# EasyEDA Pro project ProPrj_EDA-Piano2_2025-09-29.epro

# Schematic Schematic1_1
Board Name: ESP8266_PWM方案; Create Date: 2025-09-03; Page Name: P1; Project Name: EDA-Piano2; Schematic Name: Schematic1_1; Update Date: 2025-09-28; Company: 嘉立创EDA; Page Size: A4; Version: V1.0
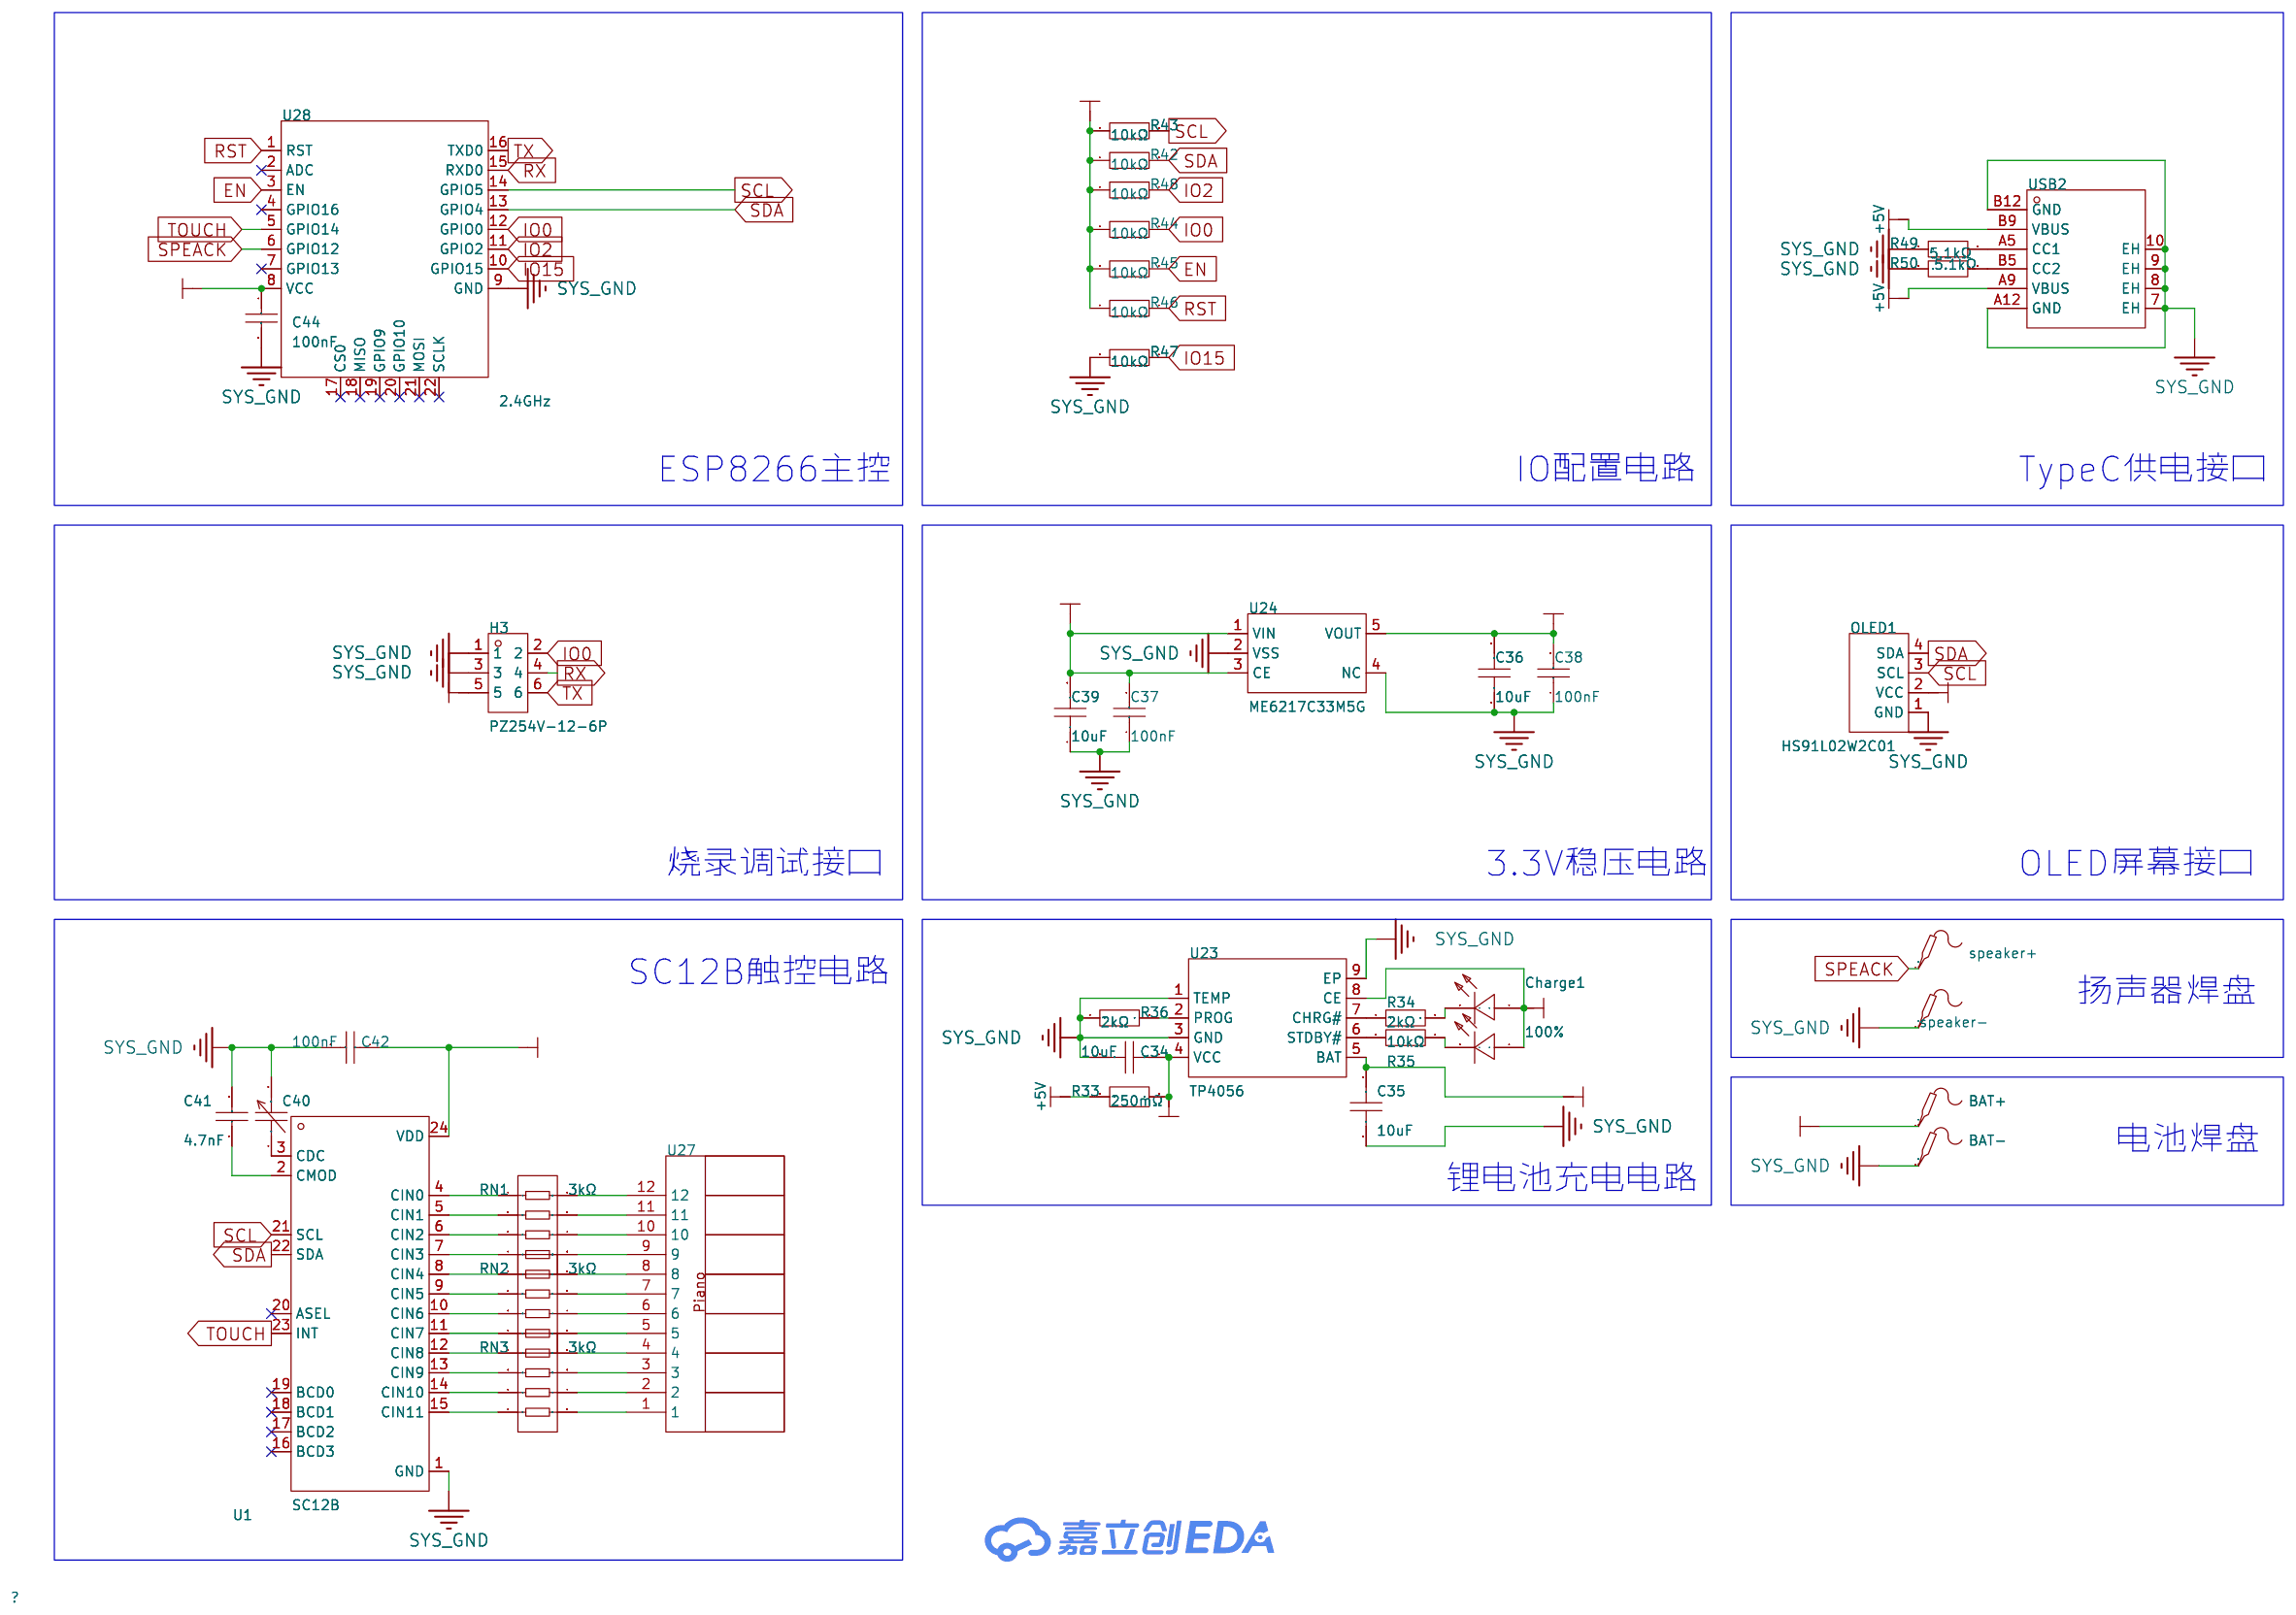
[diagram p0: schematic sheet]

## Parts
100%  NCD0805R1  [LED0805-R-RD]
BAT+  -  [Test-Point-0.5mm]
BAT-  -  [Test-Point-0.5mm]
C34  10uF  [C0805]
C35  10uF  [C0805]
C36  10uF  [C0805]
C37  100nF  [C0805]
C38  100nF  [C0805]
C39  10uF  [C0805]
C40  STC3ME30-T1  [CAP-SMD_L4.5-W3.2_SGC3S200NM]
C41  4.7nF  [C0805]
C42  100nF  [C0805]
C44  100nF  [C0805]
Charge1  NCD0805R1  [LED0805-R-RD]
H3  PZ254V-12-6P  [HDR-TH_6P-P2.54-V-M-R2-C3-S2.54]
OLED1  HS91L02W2C01  [OLED-TH_L38.0-W12.0_HS91L02W2C01]
R33  250mΩ  [R0805]
R34  2kΩ  [R0805]
R35  10kΩ  [R0805]
R36  2kΩ  [R0805]
R42  10kΩ  [R0805]
R43  10kΩ  [R0805]
R44  10kΩ  [R0805]
R45  10kΩ  [R0805]
R46  10kΩ  [R0805]
R47  10kΩ  [R0805]
R48  10kΩ  [R0805]
R49  5.1kΩ  [R0805]
R50  5.1kΩ  [R0805]
RN1  3kΩ  [RES-ARRAY-SMD_0603-8P-L3.2-W1.6-BL]
RN2  3kΩ  [RES-ARRAY-SMD_0603-8P-L3.2-W1.6-BL]
RN3  3kΩ  [RES-ARRAY-SMD_0603-8P-L3.2-W1.6-BL]
speaker+  -  [Test-Point-0.5mm]
speaker-  -  [Test-Point-0.5mm]
U1  SC12B  [SSOP-24_L8.7-W3.9-P0.64-LS6.0-BL]
U23  TP4056  [ESOP-8_L4.9-W3.9-P1.27-LS6.0-BL-EP]
U24  ME6217C33M5G  [SOT-23-5_L3.0-W1.7-P0.95-LS2.8-BR]
U27  -  [Piano]
U28  2.4GHz  [WIFIM-SMD_ESP-12F-ESP8266MOD]
USB2  U262-061N-4BVC11  [USB-SMD_U262-061N-4BVC11]

## Library data of the parts
100% Charge1 = NCD0805R1: 灯头类型:-;发光颜色:红色;正向电压(VF):1.6V~2.6V;功率:65mW;正向电流:20mA;主波长:615nm~630nm;二极管配置:独立二极管;透镜颜色:无色透明透镜;色温:-;发光强度:67mcd~195mcd;发光角度:130°;载带方式:-;工作温度:-30℃~+85℃;; Supplier Part: C84256; Manufacturer: 国星光电; Supplier Footprint: 0805; JLCPCB Part Class: Basic Part; Datasheet: https://atta.szlcsc.com/upload/public/pdf/source/20200820/C84256_F0A75A43B3EAD75808600A0514C76B99.pdf; Supplier: LCSC; Emitted Color: 红色; Forward Voltage (VF): 1.6V~2.6V; Power Dissipation: 65mW; Forward Current: 20mA; Dominant Wavelength: 615nm~630nm; Diode Configuration: 独立二极管; Lens Color: 无色透明透镜; Luminous Intensity: 67mcd~195mcd; Viewing Angle: 130°; Operating Temperature: -30℃~+85℃
BAT+ BAT- speaker+ speaker- = Test-Point: Test Point 测试点
C34 C35 = CGA0805X5R106K250MT: 容值:10uF;精度:±10%;额定电压:25V;温度系数:X5R;; LCSC Part Name: 10uF ±10% 25V; Supplier Part: C6119887; Manufacturer: HRE(芯声); Supplier Footprint: 0805; JLCPCB Part Class: Extended Part; Supplier: LCSC; Tolerance: ±10%; Voltage Rating: 25V; Temperature Coefficient: X5R
C36 C39 = CL21A106KAYNNNE_C15850: 容值:10uF;精度:±10%;额定电压:25V;材质(温度系数):X5R;; LCSC Part Name: 10uF ±10% 25V; Supplier Part: C15850; Manufacturer: SAMSUNG(三星); Manufacturer Part: CL21A106KAYNNNE; Supplier Footprint: 0805; JLCPCB Part Class: 基础库; Datasheet: https://atta.szlcsc.com/upload/public/pdf/source/20160218/1457707763339.pdf; Supplier: LCSC; Tolerance: ±10%; Voltage Rated: 25V; Temperature Coefficient: X5R
C37 C38 C42 C44 = FCC0805B104K500DT: 容值:100nF;精度:±10%;额定电压:50V;温度系数:X7R;; LCSC Part Name: 100nF ±10% 50V; Supplier Part: C5137467; Manufacturer: FOJAN(富捷); Supplier Footprint: 0805; JLCPCB Part Class: Extended Part; Datasheet: https://atta.szlcsc.com/upload/public/pdf/source/20220818/0EB3B7FB2F5648AC16609637FBA7DABE.pdf; Supplier: LCSC; Tolerance: ±10%; Voltage Rating: 50V; Temperature Coefficient: X7R
C40 = STC3ME30-T1_C22468123: 静电容量:8pF~28.5pF;静电容量公差:0%~+50%;额定电压(Vdc):100V;Q值:250@1MHz;; LCSC Part Name: 8pF~28.5pF 100V; Supplier Part: C22468123; Manufacturer: SEHWA(韩国世华); Supplier Footprint: SMD,4.5x3.2mm; JLCPCB Part Class: 扩展库; Datasheet: https://atta.szlcsc.com/upload/public/pdf/source/20240625/55C7A7A8763FD4208BA2F5E12AB1C3D3.pdf; Supplier: LCSC; electrostatic capacity: 8pF~28.5pF; Tolerance: 0%~+50%; Rated Voltage: 100V; Q @ Freq: 250@1MHz; Operating Temperature: -25℃~+85℃; Body Length: 4.5mm; Body Width: 3.2mm; Body Height: 1.5mm
C41 = 0805B472K500NT: 容值:4.7nF;精度:±10%;额定电压:50V;温度系数:X7R;; LCSC Part Name: 4.7nF ±10% 50V; Supplier Part: C1744; Manufacturer: FH(风华); Supplier Footprint: 0805; JLCPCB Part Class: 基础库; Datasheet: https://atta.szlcsc.com/upload/public/pdf/source/20200305/C486355_26A10D38EF8C2A5C37091D0039909270.pdf; Supplier: LCSC; Tolerance: ±10%; Voltage Rating: 50V; Temperature Coefficient: X7R
H3 = PZ254V-12-6P: 插针结构:2x3P;间距:2.54mm;行距:2.54mm;圆针/方针:方针;安装类型:直插;排数:双排;总PIN位数:6P;额定电流:-;额定电压:-;配合针长度:6mm;塑高:2.5mm;端接针长度:3mm;触头材质:黄铜;触头镀层:-;工作温度范围:-40℃~+105℃;颜色:黑色;; LCSC Part Name: 间距:2.54mm 2x3P 直插 方针; Supplier Part: C492420; Manufacturer: XFCN(兴飞); Supplier Footprint: 插件,P=2.54mm; JLCPCB Part Class: 扩展库; Datasheet: https://atta.szlcsc.com/upload/public/pdf/source/20200309/C492420_BAECB307B001054C09D200388220EAE6.pdf; Supplier: LCSC; Pin Structure: 2x3P; Pitch: 2.54mm; Row Spacing: 2.54mm; Circluar Pins/Square Pins: 方针; Mounting Type: 直插; Number of Rows: 双排; Number of Pins: 6P; Length of Mating Pin: 6mm; Insulation Height: 2.5mm; Length of End Connection Pin: 3mm; Contact Material: 黄铜; Operating Temperature Range: -40℃~+105℃; Color: 黑色
OLED1 = HS91L02W2C01: 主控芯片:SSD1306;接口类型:I2C;尺寸(inch):0.91;像素分辨率:128x32;; LCSC Part Name: 0.91寸OLED显示屏白光IIC; Supplier Part: C5248081; Manufacturer: HS(汉昇); JLCPCB Part Class: 扩展库; Datasheet: https://atta.szlcsc.com/upload/public/pdf/source/20230727/C3E43C8E3DDA847F5681FEE7D95C153D.pdf; Supplier: LCSC; Main Control Chip: SSD1306; Interface Type: I2C; Size: 0.91; Pixel Resolution: 128x32; Operating Temperature: -40℃~+70℃
R33 = FRL0805JR250TS: 电阻类型:厚膜电阻;阻值:250mΩ;精度:±5%;功率:125mW;最大工作电压:300V;温度系数:±300ppm/℃;; LCSC Part Name: 250mΩ ±5% 125mW 厚膜电阻; Supplier Part: C2930324; Manufacturer: FOJAN(富捷); Supplier Footprint: 0805; JLCPCB Part Class: 扩展库; Datasheet: https://atta.szlcsc.com/upload/public/pdf/source/20211221/925EC7D7225764EE0046F22065062C87.pdf; Supplier: LCSC; Type: 厚膜电阻; Tolerance: ±5%; Power(Watts): 125mW; Overload Voltage (Max): 300V; Temperature Coefficient: ±300ppm/℃; Operating Temperature Range: -55℃~+155℃
R34 R36 = 0805W8F2001T5E: 电阻类型:厚膜电阻;阻值:2kΩ;精度:±1%;功率:125mW;最大工作电压:150V;温度系数:±100ppm/℃;; LCSC Part Name: 2kΩ ±1% 125mW 厚膜电阻; Supplier Part: C17604; Manufacturer: UNI-ROYAL(厚声); Supplier Footprint: 0805; JLCPCB Part Class: 基础库; Datasheet: https://atta.szlcsc.com/upload/public/pdf/source/20200306/C422600_1E6D84923E4A46A82E41ADD87F860B5C.pdf; Supplier: LCSC; Type: 厚膜电阻; Tolerance: ±1%; Power(Watts): 125mW; Overload Voltage (Max): 150V; Temperature Coefficient: ±100ppm/℃; Operating Temperature Range: -55℃~+155℃
R35 R42-R48 = 0805W8F1002T5E_C17414: 电阻类型:厚膜电阻;阻值:10kΩ;精度:±1%;功率:125mW;最大工作电压:150V;温度系数:±100ppm/℃;; LCSC Part Name: 10kΩ ±1% 125mW 厚膜电阻; Supplier Part: C17414; Manufacturer: UNI-ROYAL(厚声); Manufacturer Part: 0805W8F1002T5E; Supplier Footprint: 0805; JLCPCB Part Class: Basic Part; Datasheet: https://atta.szlcsc.com/upload/public/pdf/source/20200306/C422600_1E6D84923E4A46A82E41ADD87F860B5C.pdf; Supplier: LCSC; Type: 厚膜电阻; Tolerance: ±1%; Power(Watts): 125mW; Overload Voltage (Max): 150V; Temperature Coefficient: ±100ppm/℃; Operating Temperature Range: -55℃~+155℃
R49 R50 = 0805W8F5101T5E: 电阻类型:厚膜电阻;阻值:5.1kΩ;精度:±1%;功率:125mW;工作电压:150V;温度系数:±100ppm/℃;; LCSC Part Name: 5.1kΩ ±1% 125mW 厚膜电阻; Supplier Part: C27834; Manufacturer: UNI-ROYAL(厚声); Supplier Footprint: 0805; JLCPCB Part Class: 基础库; Datasheet: https://item.szlcsc.com/datasheet/0805W8F5101T5E/28584.html; Supplier: LCSC; Type: 厚膜电阻; Tolerance: ±1%; Power(Watts): 125mW; Voltage-Supply(Max): 150V; Temperature Coefficient: ±100ppm/℃; Operating Temperature: -55℃~+155℃
RN1-RN3 = 4D03WGF3001T5E: 电阻器数:4;阻值:3kΩ;精度:±1%;单个元件功率:62.5mW;温度系数:±200ppm/℃;; LCSC Part Name: 3kΩ ±1%; Supplier Part: C425221; Manufacturer: UNI-ROYAL(厚声); Supplier Footprint: 0603x4; JLCPCB Part Class: 扩展库; Datasheet: https://item.szlcsc.com/datasheet/4D03WGF3001T5E/418845.html; Supplier: LCSC; Number of Resistors: 4; Tolerance: ±1%; Power(Watts): 62.5mW; Temperature Coefficient: ±200ppm/℃; Number of Pins: 8
U1 = SC12B: 通道数:12;芯片功能:电容式触摸;是否自锁:-;; LCSC Part Name: 12通道高性能触摸芯片,2.5V-6V; Supplier Part: C718973; Manufacturer: icman(晶尊微); Supplier Footprint: SSOP-24-150mil; JLCPCB Part Class: 扩展库; Datasheet: https://item.szlcsc.com/datasheet/SC12B/761516.html; Supplier: LCSC; Number of Channels: 12; Chip Function: 电容式触摸; Voltage - Supply: 2.5V~6V; Operating Temperature: -40℃~+85℃
U23 = TP4056_C725790: Supplier Part: C725790; Manufacturer: UMW(友台半导体); Supplier Footprint: ESOP-8; JLCPCB Part Class: 扩展库; Datasheet: https://atta.szlcsc.com/upload/public/pdf/source/20231109/CF74897CE79A500F7FE27A45ADCCC631.pdf; Supplier: LCSC
U24 = ME6217C33M5G: 输出类型:固定;工作电压:6.5V;输出电压:3.3V;输出电流:800mA;电源纹波抑制比(PSRR):65dB@(1kHz);输出极性:正极;; LCSC Part Name: 输入7V 输出3.3V 800mA; Supplier Part: C427602; Manufacturer: MICRONE(南京微盟); Supplier Footprint: SOT-23-5; JLCPCB Part Class: 扩展库; Datasheet: https://atta.szlcsc.com/upload/public/pdf/source/20190910/C427602_D4B9162A2E9D9EF57C60010DFDECEF37.pdf; Supplier: LCSC; Output Type: 固定; Voltage - Supply: 6.5V; Output Voltage: 3.3V; Output Current: 800mA; Power Supply Rejection Ratio (PSRR): 65dB@(1kHz); Voltage Dropout: 180mV@(300mA); standby current: 100uA; Features: 过热保护；带使能; Operating Temperature: -40℃~+85℃; Output Configuration: 正极; Number of Outputs: 1
U27 = Piano
U28 = ESP-12F(ESP8266MOD): 核心处理器:ESP8266芯片;频率:2.4GHz;天线形式:板载PCB天线;发射功率:16dBm;接收灵敏度:-90dBm;; LCSC Part Name: 完整的802.11b/g/nWi-FiSoC模块 屏蔽罩上的丝印是：ESP8266MOD，ESP8266EX串口WIFI; Supplier Part: C82891; Manufacturer: Ai-Thinker(安信可); Supplier Footprint: SMD,16x24mm; JLCPCB Part Class: 扩展库; Datasheet: https://atta.szlcsc.com/upload/public/pdf/source/20210219/C82891_ABD84A460F4F056A2757267CCCA4B508.pdf; Supplier: LCSC; Core Processor: ESP8266芯片; Support Interface: GPIO；UART；I2C；PWM；SPI；ADC; Antenna Type: 板载PCB天线; Output Power: 16dBm; Operating Voltage: 3.3V; Receive  Current: 120mA; Send  Current: 170mA; Sensitivity: -90dBm; Operating Temperature: -40℃~+85℃
USB2 = U262-061N-4BVC11: 连接器类型:Type-C;标准:USB 3.1;公母:母;端口数量:1;触点数量:6P;安装方式:卧贴;额定电流 - 电源:5A;触头材质:铜合金;触头镀层:金;工作温度范围:-25℃~+85℃;焊接温度(最大值):260℃;; LCSC Part Name: Type-C 母 卧贴; Supplier Part: C2764612; Manufacturer: XKB Connection(中国星坤); Supplier Footprint: SMD; JLCPCB Part Class: 扩展库; Datasheet: https://atta.szlcsc.com/upload/public/pdf/source/20210602/C2764612_915BA3D27A0B76A9D989108E3A082B29.pdf; Supplier: LCSC; Connector Type: Type-C; Standard: USB 3.1; Gender: 母; Number of Ports: 1; Number of Contacts: 6P; Mounting Style: 卧贴; Current Rating - Power (Max): 5A; Contact Material: 铜合金; Contact Plating: 金; Operating Temperature Range: -25℃~+85℃; Soldering Temperature(Max): 260℃

## Nets
+5V: R33.1 USB2.A9(VBUS) USB2.B9(VBUS)
BAT: BAT+.1 C35.1 C37.2 C39.2 U23.5(BAT) U24.1(VIN) U24.3(CE)
EN: R45.1 U28.3(EN)
IO0: H3.2 R44.1 U28.12(GPIO0)
IO2: R48.1 U28.11(GPIO2)
IO15: R47.1 U28.10(GPIO15)
RST: R46.1 U28.1(RST)
RX: H3.4 U28.15(RXD0)
SCL: OLED1.3(SCL) R43.2 U1.21(SCL) U28.14(GPIO5)
SDA: OLED1.4(SDA) R42.2 U1.22(SDA) U28.13(GPIO4)
SPEACK: speaker+.1 U28.6(GPIO12)
SYS_GND: BAT-.1 C34.2 C35.2 C36.1 C37.1 C38.1 C39.1 C40.2 C41.2 C42.2 C44.2 H3.1 H3.3 OLED1.1(GND) R36.1 R47.2 R49.1 R50.1 speaker-.1 U1.1(GND) U23.1(TEMP) U23.3(GND) U23.9(EP) U24.2(VSS) U24.4(NC) U28.9(GND) USB2.7(EH) USB2.8(EH) USB2.9(EH) USB2.10(EH) USB2.A12(GND) USB2.B12(GND)
SYSTEM_3V3: C36.2 C38.2 C42.1 C44.1 H3.5 OLED1.2(VCC) R42.1 R43.1 R44.2 R45.2 R46.2 R48.2 U1.24(VDD) U24.5(VOUT) U28.8(VCC)
TOUCH: U1.23(INT) U28.5(GPIO14)
TP4056_VCC: 100%.1(+) C34.1 Charge1.1(+) R33.2 U23.4(VCC) U23.8(CE)
TX: H3.6 U28.16(TXD0)
$1N1082: 100%.2(-) R35.1
$1N1083: R35.2 U23.6(STDBY#)
$1N1087: R34.1 U23.7(CHRG#)
$1N1088: Charge1.2(-) R34.2
$1N1093: R36.2 U23.2(PROG)
$1N5168: C40.1 U1.3(CDC)
$1N5240: C41.1 U1.2(CMOD)
$1N9530: RN1.4 U1.4(CIN0)
$1N9534: RN1.5 U27.12
$1N9539: RN1.6 U27.11
$1N9544: RN1.7 U27.10
$1N9549: RN1.8 U27.9
$1N9554: RN2.5 U27.8
$1N9559: RN2.6 U27.7
$1N9564: RN2.7 U27.6
$1N9569: RN2.8 U27.5
$1N9574: RN3.5 U27.4
$1N9579: RN3.6 U27.3
$1N9584: RN3.7 U27.2
$1N9589: RN3.8 U27.1
$1N9594: RN3.1 U1.15(CIN11)
$1N9599: RN3.2 U1.14(CIN10)
$1N9607: RN3.3 U1.13(CIN9)
$1N9626: RN2.2 U1.10(CIN6)
$1N9631: RN2.3 U1.9(CIN5)
$1N9636: RN2.4 U1.8(CIN4)
$1N9641: RN1.1 U1.7(CIN3)
$1N9648: RN1.2 U1.6(CIN2)
$1N9654: RN1.3 U1.5(CIN1)
$1N9658: RN2.1 U1.11(CIN7)
$1N9661: RN3.4 U1.12(CIN8)
$1N13236: R49.2 USB2.A5(CC1)
$1N13292: R50.2 USB2.B5(CC2)

Not connected (* = marked no-connect by the designer): U1 16(BCD3)* 17(BCD2)* 18(BCD1)* 19(BCD0)* 20(ASEL)*; U28 2(ADC)* 4(GPIO16)* 7(GPIO13)* 17(CS0)* 18(MISO)* 19(GPIO9)* 20(GPIO10)* 21(MOSI)* 22(SCLK)*

## Notes on the sheet
- ESP8266主控
- IO配置电路
- TypeC供电接口
- 烧录调试接口
- 3.3V稳压电路
- OLED屏幕接口
- SC12B触控电路
- 扬声器焊盘
- 电池焊盘
- 锂电池充电电路

# Board PCB1_1
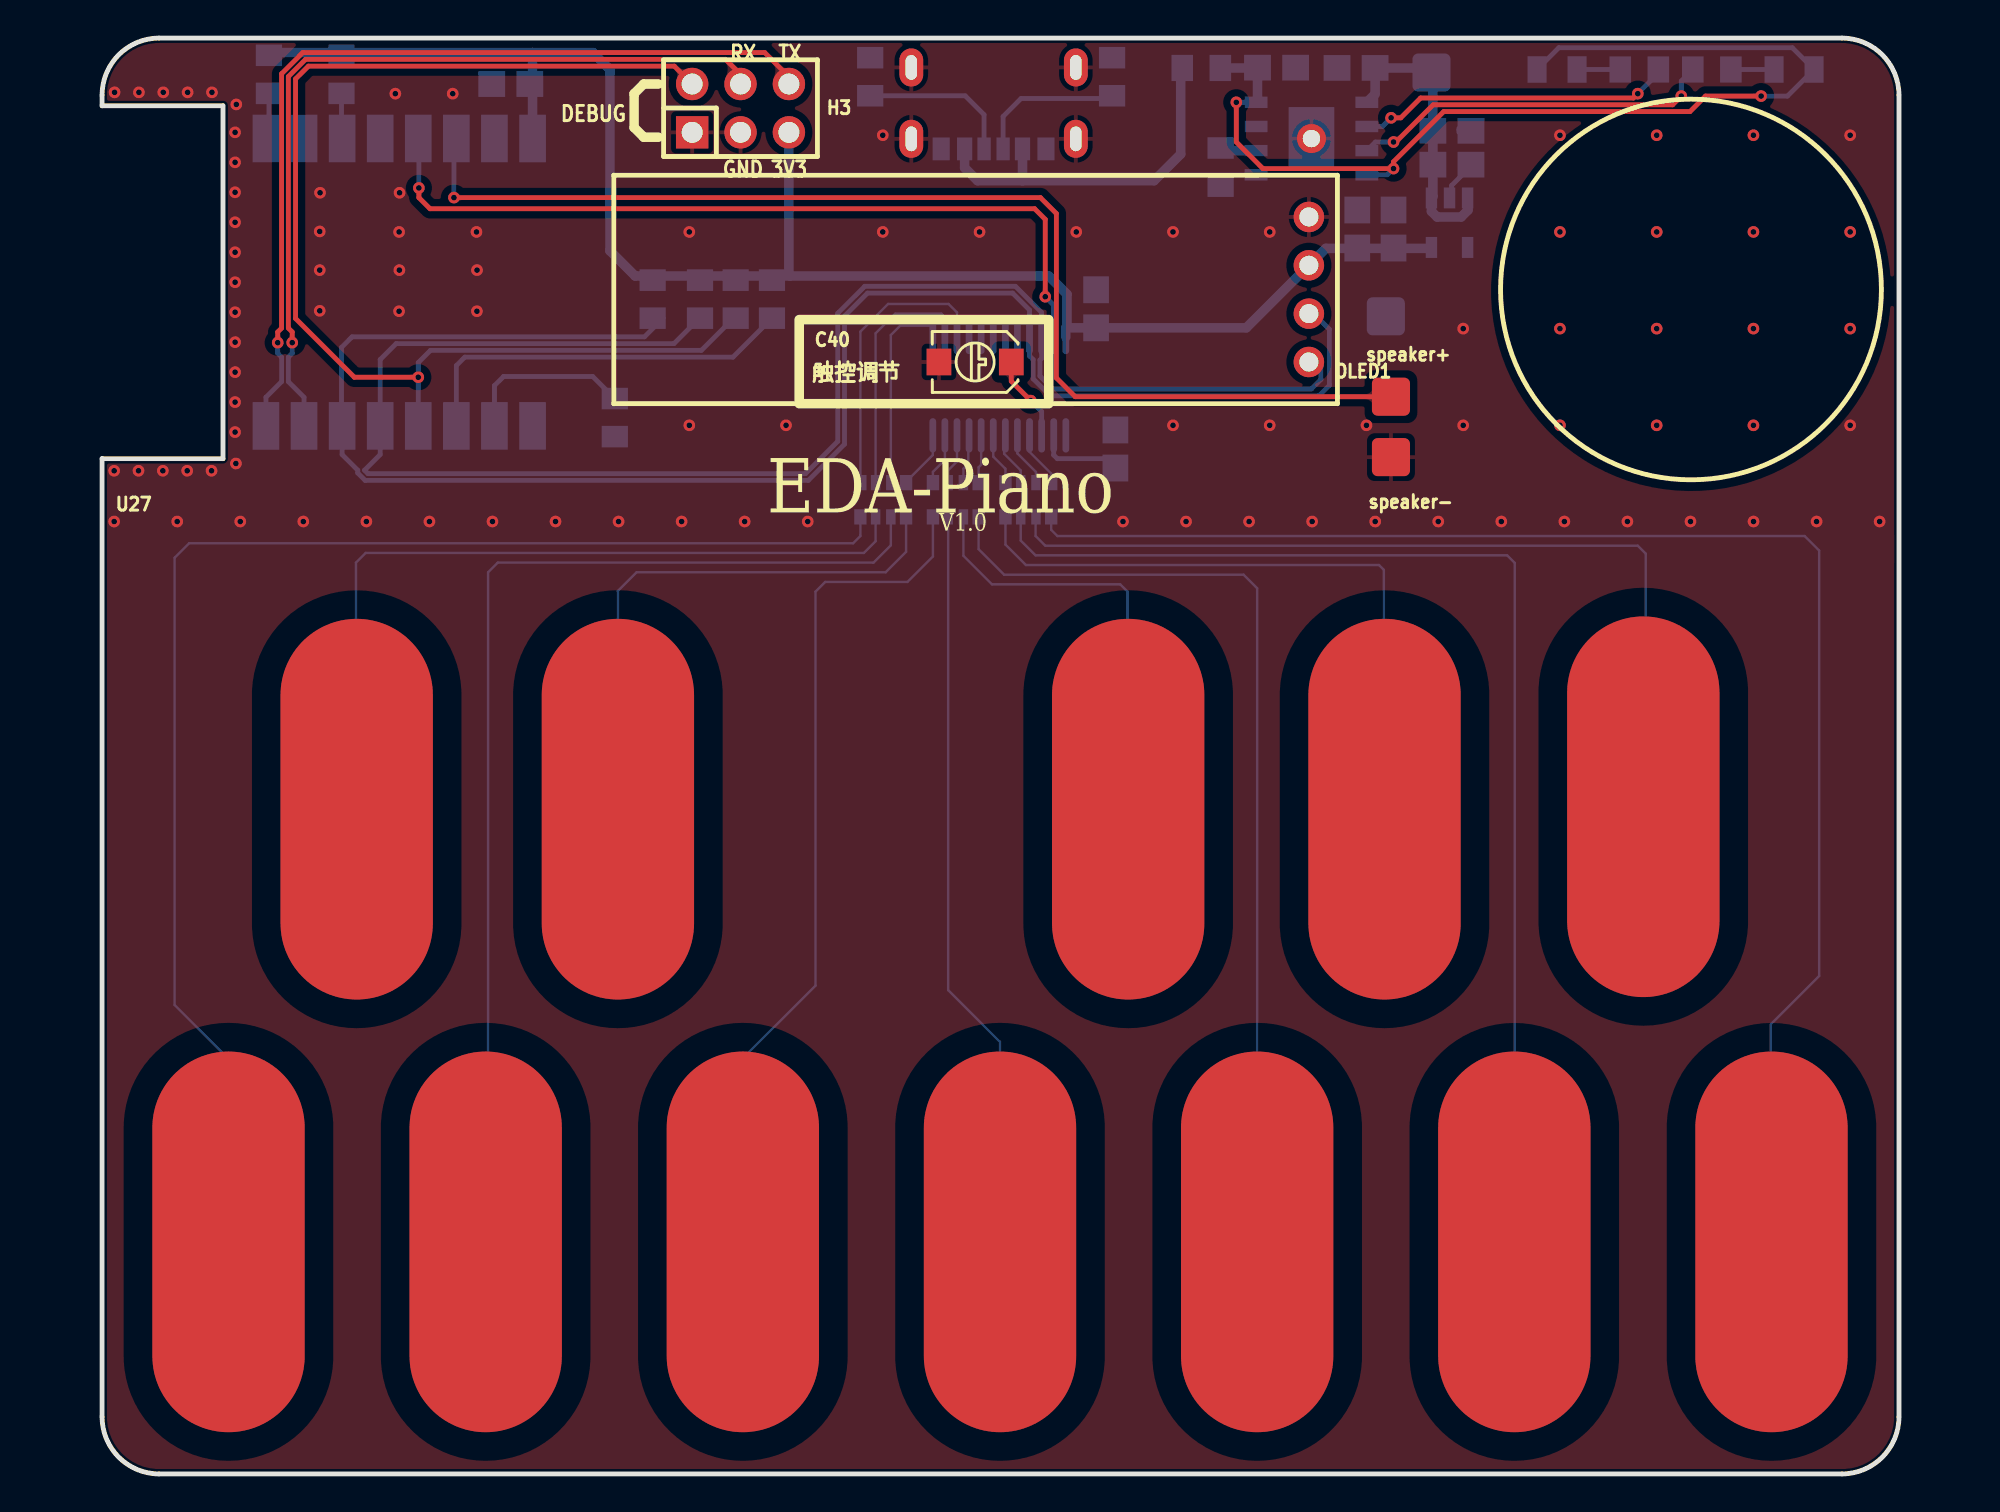
[diagram p1: board, top side]
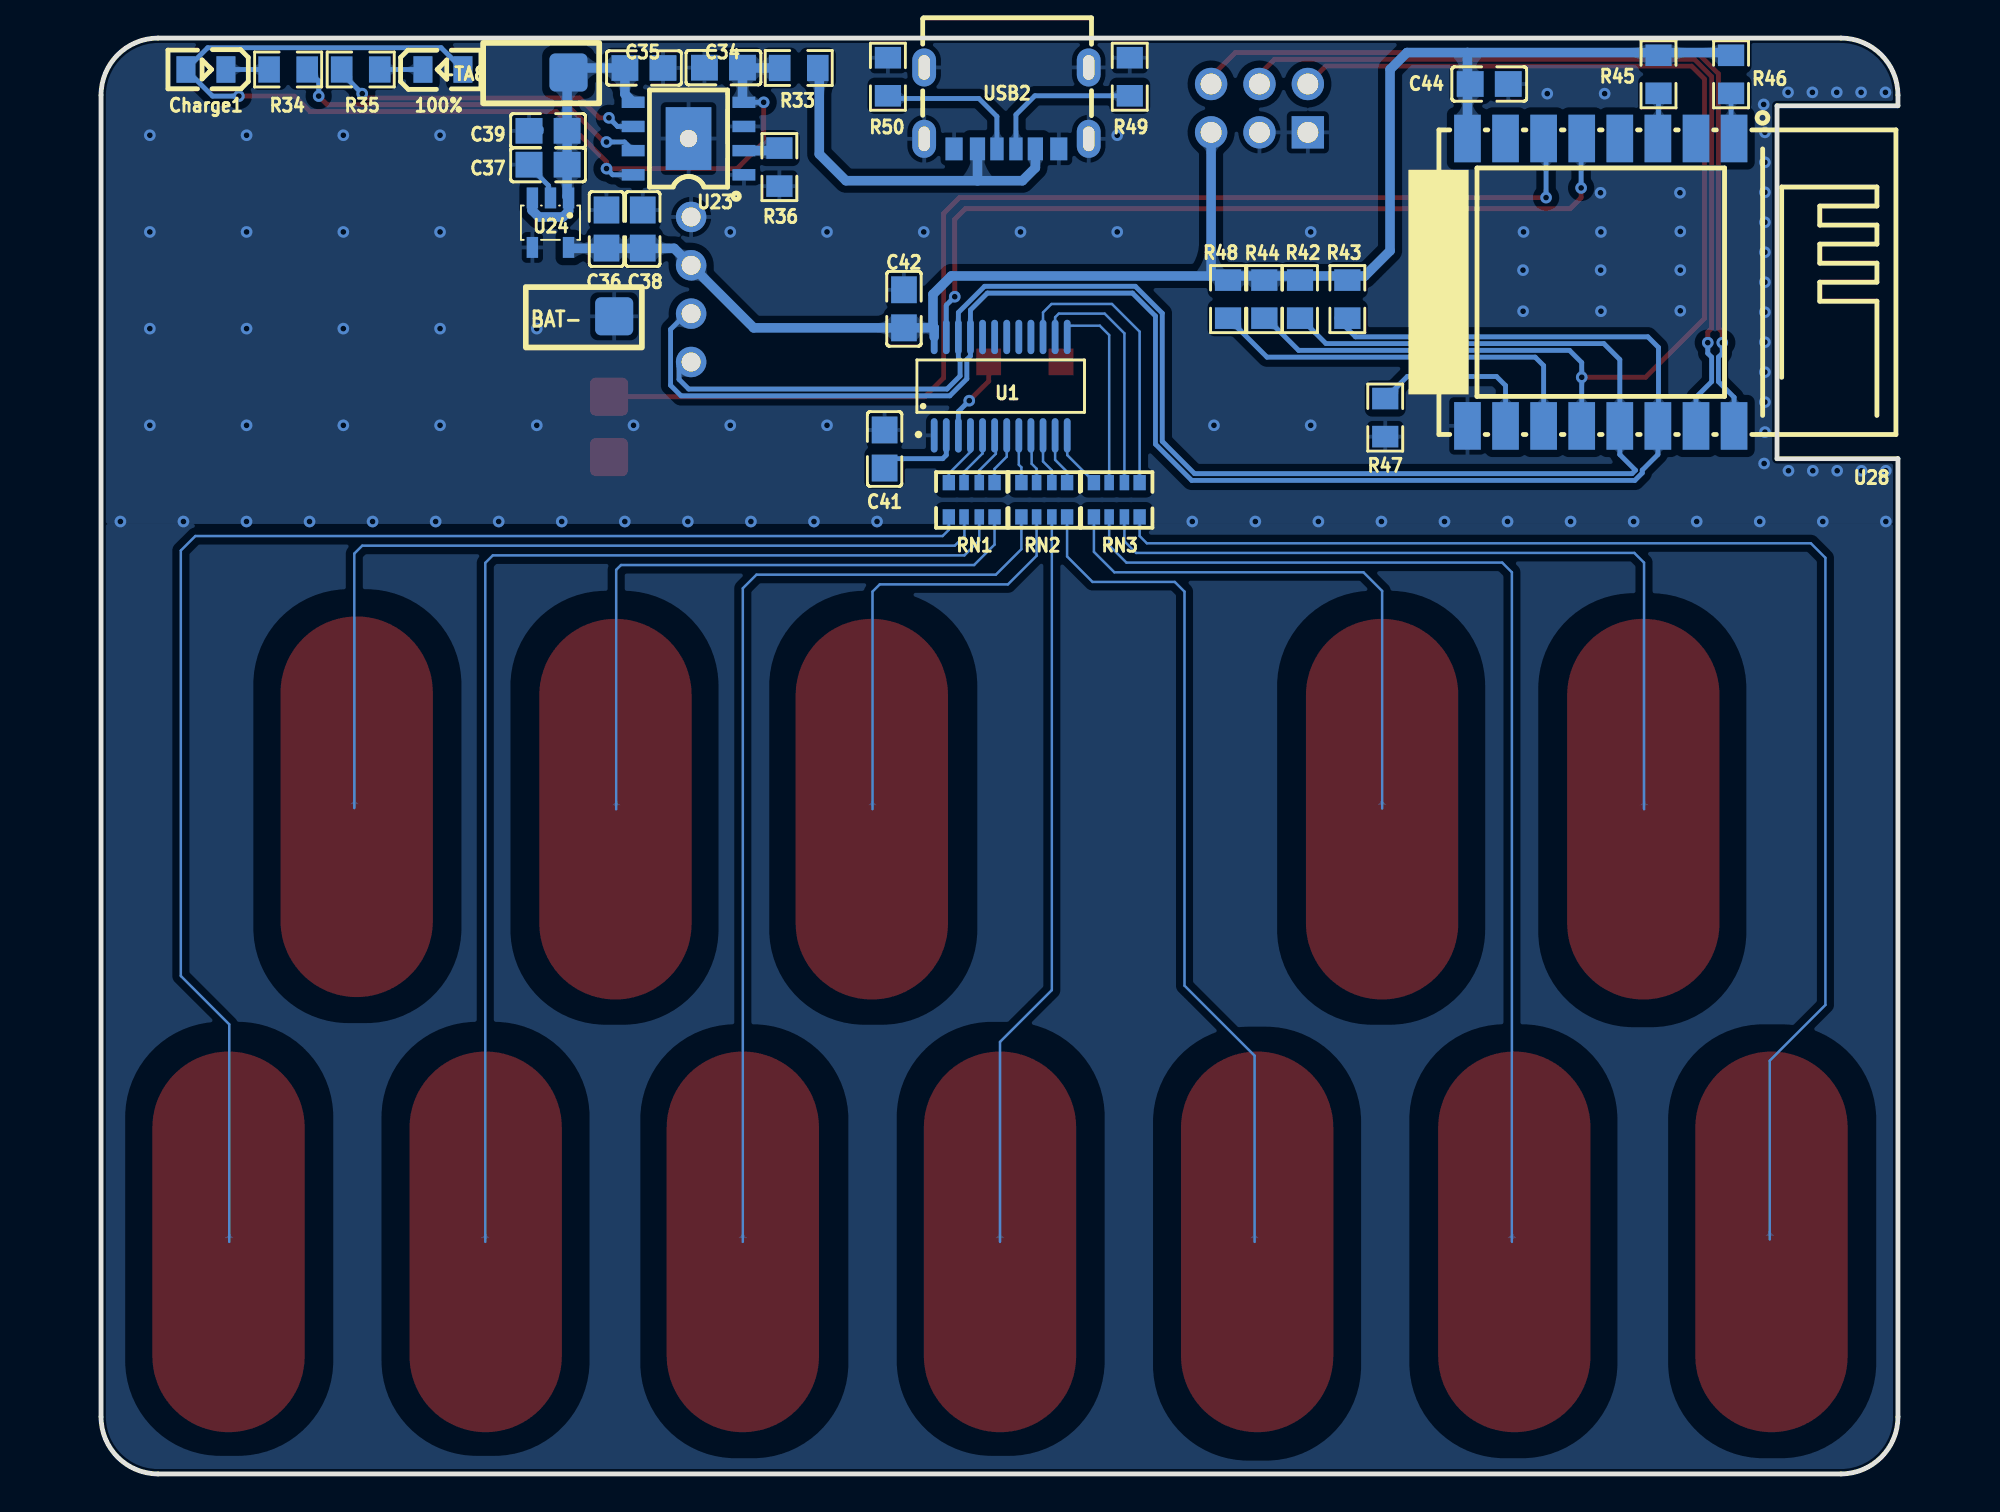
[diagram p2: board, bottom side, seen from below]

Outline 94.36 x 75.44 mm; copper layers: Top Layer, Bottom Layer. Coordinates in mm from the lower left corner of the outline.
Outline path: 0,72.44 0,71.88 6.35,71.88 6.35,53.34 0,53.34 0,3 arc(0.88,0.88) 3,0 91.36,0 arc(93.48,0.88) 94.36,3 94.36,72.44 arc(93.48,74.56) 91.36,75.44 3,75.44 arc(0.88,74.56) 0,72.44
Stack: Top Layer 0.035mm / Dielectric1 1.51mm FR4 er 4.5 / Bottom Layer 0.035mm

## Design rules (mm)
template: 自定义配置
spacing copperThickness1oz (default): track to track 0.102, other pairs 0.152 to 0.3
spacing copperThickness2oz: track to track 0.381, other pairs 0.152 to 0.3
track width copperThickness1oz (default): min 0.127, default 0.254, max 2.54
track width copperThickness2oz: min 0.127, default 0.127, max 0.203
differential pair differentialPair (default): width min 0.127, default 0.254, max 2.54; gap min 0.152, default 0.152
via viaSize (default): diameter min 0.5, default 0.61, max 10; hole min 0.3, default 0.305, max 6.3
net $1N9648 uses copperThickness2oz
net $1N9641 uses copperThickness2oz
net $1N9626 uses copperThickness2oz
net $1N9599 uses copperThickness2oz
net $1N9594 uses copperThickness2oz
net $1N9530 uses copperThickness2oz
net $1N9654 uses copperThickness2oz
net $1N9636 uses copperThickness2oz
net $1N9631 uses copperThickness2oz
net $1N9607 uses copperThickness2oz
net $1N9589 uses copperThickness2oz
net $1N9584 uses copperThickness2oz
net $1N9579 uses copperThickness2oz
net $1N9574 uses copperThickness2oz
net $1N9569 uses copperThickness2oz
net $1N9564 uses copperThickness2oz
net $1N9559 uses copperThickness2oz
net $1N9554 uses copperThickness2oz
net $1N9549 uses copperThickness2oz
net $1N9544 uses copperThickness2oz
net $1N9539 uses copperThickness2oz
net $1N9534 uses copperThickness2oz
pour e21 uses copperRegion1

## Placement (name value [footprint] x y rotation side)
100%  NCD0805R1  [LED0805-R-RD]  76.41 73.79 180 bottom
BAT+  -  [Test-Point-0.5mm#2]  69.81 73.63 0 top
BAT-  -  [Test-Point-0.5mm#2]  67.41 60.82 0 top
C34  10uF  [C0805]  61.68 73.88 0 bottom
C35  10uF  [C0805]  65.85 73.87 180 bottom
C36  10uF  [C0805]  67.82 65.4 270 bottom
C37  100nF  [C0805]  70.89 68.79 180 bottom
C38  100nF  [C0805]  65.91 65.4 270 bottom
C39  10uF  [C0805]  70.89 70.56 180 bottom
C40  STC3ME30-T1  [CAP-SMD_L4.5-W3.2_SGC3S200NM]  45.85 58.42 180 top
C41  4.7nF  [C0805]  53.21 53.85 90 bottom
C42  100nF  [C0805]  52.2 61.21 90 bottom
C44  100nF  [C0805]  21.46 73.02 180 bottom
Charge1  NCD0805R1  [LED0805-R-RD]  88.85 73.79 0 bottom
H3  PZ254V-12-6P  [HDR-TH_6P-P2.54-V-M-R2-C3-S2.54]  33.53 71.75 0 top
NOREF  -  [Pad_e327]  63.51 70.16 0 top
OLED1  HS91L02W2C01  [OLED-TH_L38.0-W12.0_HS91L02W2C01]  63.37 62.23 180 top
R33  250mΩ  [R0805]  57.72 73.87 0 bottom
R34  2kΩ  [R0805]  84.53 73.79 0 bottom
R35  10kΩ  [R0805]  80.72 73.79 0 bottom
R36  2kΩ  [R0805]  58.74 68.66 90 bottom
R42  10kΩ  [R0805]  31.4 61.72 270 bottom
R43  10kΩ  [R0805]  28.91 61.72 270 bottom
R44  10kΩ  [R0805]  33.27 61.72 90 bottom
R45  10kΩ  [R0805]  12.57 73.53 90 bottom
R46  10kΩ  [R0805]  8.76 73.53 90 bottom
R47  10kΩ  [R0805]  26.92 55.5 270 bottom
R48  10kΩ  [R0805]  35.18 61.72 90 bottom
R49  5.1kΩ  [R0805]  40.34 73.41 270 bottom
R50  5.1kΩ  [R0805]  53.04 73.41 270 bottom
RN1  3kΩ  [RES-ARRAY-SMD_0603-8P-L3.2-W1.6-BL]  48.64 51.18 0 bottom
RN2  3kΩ  [RES-ARRAY-SMD_0603-8P-L3.2-W1.6-BL]  44.83 51.18 0 bottom
RN3  3kΩ  [RES-ARRAY-SMD_0603-8P-L3.2-W1.6-BL]  41.02 51.18 0 bottom
speaker+  -  [Test-Point-0.5mm]  67.68 56.6 0 top
speaker-  -  [Test-Point-0.5mm]  67.68 53.42 0 top
U1  SC12B  [SSOP-24_L8.7-W3.9-P0.64-LS6.0-BL]  47.12 57.15 180 bottom
U23  TP4056  [ESOP-8_L4.9-W3.9-P1.27-LS6.0-BL-EP]  63.51 70.16 90 bottom
U24  ME6217C33M5G  [SOT-23-5_L3.0-W1.7-P0.95-LS2.8-BR]  70.76 65.74 90 bottom
U27  -  [Piano]  -2.29 1.14 0 top
U28  2.4GHz  [WIFIM-SMD_ESP-12F-ESP8266MOD]  16.26 62.61 0 bottom
USB2  U262-061N-4BVC11  [USB-SMD_U262-061N-4BVC11]  46.82 71.75 0 bottom

## Footprints (pads in the part's own frame, mm; a bottom-side part is the same pattern mirrored in y, then rotated)
C0805
  rect 1.41x1.35 smd: 1(-1,0) 2(1,0)
CAP-SMD_L4.5-W3.2_SGC3S200NM
  rect 1.3x1.4 smd: 1(-1.9,0) 2(1.9,0)
ESOP-8_L4.9-W3.9-P1.27-LS6.0-BL-EP
  rect 0.6x1.2 smd: 1(-1.905,-2.909) 2(-0.635,-2.909) 3(0.635,-2.909) 4(1.905,-2.909) 5(1.905,2.909) 6(0.635,2.909) 7(-0.635,2.909) 8(-1.905,2.909)
  rect 3.3x2.4 smd: 9(0,0)
HDR-TH_6P-P2.54-V-M-R2-C3-S2.54
  rect 1.7x1.7 hole 1.1: 1(-2.54,-1.27)
  round 1.7 hole 1.1: 2(-2.54,1.27) 3(0,-1.27) 4(0,1.27) 5(2.54,-1.27) 6(2.54,1.27)
LED0805-R-RD
  rect 1x1.399 smd: 1(1.05,0) 2(-1.05,0)
OLED-TH_L38.0-W12.0_HS91L02W2C01
  round 1.6 hole 1: 1(0,-3.81) 2(0,-1.27) 3(0,1.27) 4(0,3.81)
Pad_e327
  round 1.524 hole 0.914: 1(0,0)
Piano
  oval 8x20 smd: 1(8.927,11.049) 2(15.658,33.782) 3(22.431,11.049) 4(29.373,33.782) 5(35.935,11.049) 6(49.44,11.049) 7(56.17,33.782) 8(62.944,11.049) 9(69.632,33.782) 10(76.448,11.049) 11(83.222,33.909) 12(89.953,11.049)
R0805
  rect 1.133x1.377 smd: 1(-1,0) 2(1,0)
RES-ARRAY-SMD_0603-8P-L3.2-W1.6-BL
  rect 0.65x0.8 smd: 1(-1.2,-0.9) 4(1.2,-0.9) 5(1.2,0.9) 8(-1.2,0.9)
  rect 0.5x0.8 smd: 2(-0.4,-0.9) 3(0.4,-0.9) 6(0.4,0.9) 7(-0.4,0.9)
SOT-23-5_L3.0-W1.7-P0.95-LS2.8-BR
  rect 1.1x0.6 smd: 1(1.3,-0.95) 2(1.3,0) 3(1.3,0.95) 4(-1.3,0.95) 5(-1.3,-0.95)
SSOP-24_L8.7-W3.9-P0.64-LS6.0-BL
  oval 0.355x1.805 smd: 1(-3.493,-2.585) 2(-2.857,-2.585) 3(-2.223,-2.585) 4(-1.587,-2.585) 5(-0.953,-2.585) 6(-0.318,-2.585) 7(0.318,-2.585) 8(0.953,-2.585) 9(1.587,-2.585) 10(2.223,-2.585) 11(2.857,-2.585) 12(3.493,-2.585) 13(3.493,2.585) 14(2.857,2.585) 15(2.223,2.585) 16(1.587,2.585) 17(0.953,2.585) 18(0.318,2.585) 19(-0.318,2.585) 20(-0.953,2.585) 21(-1.587,2.585) 22(-2.223,2.585) 23(-2.857,2.585) 24(-3.493,2.585)
Test-Point-0.5mm
  rrect 2x2 smd: 1(0,0)
Test-Point-0.5mm#2
  rrect 2x2 smd far side: 1(0,0)
USB-SMD_U262-061N-4BVC11
  oval 1.25x2 hole 0.6x1.3: 7(-4.32,1.611) 8(4.32,1.611) 9(-4.32,-2.139) 10(4.32,-2.139)
  rect 0.7x1.2 smd: A5(-0.5,2.139) B5(0.5,2.139)
  rect 0.8x1.2 smd: A9(1.52,2.139) B9(-1.52,2.139)
  rect 0.9x1.2 smd: A12(2.75,2.139) B12(-2.75,2.139)
WIFIM-SMD_ESP-12F-ESP8266MOD
  rect 1.4x2.5 smd: 1(-7.651,-7.551) 2(-5.651,-7.551) 3(-3.651,-7.551) 4(-1.651,-7.551) 5(0.349,-7.551) 6(2.349,-7.551) 7(4.349,-7.551) 8(6.349,-7.551) 9(6.349,7.548) 10(4.349,7.55) 11(2.349,7.551) 12(0.349,7.551) 13(-1.651,7.55) 14(-3.651,7.551) 15(-5.651,7.551) 16(-7.651,7.551)

## Nets
As in the schematic, except:
SYS_GND: BAT-.1 C34.2 C35.2 C36.1 C37.1 C38.1 C39.1 C40.2 C41.2 C42.2 C44.2 H3.1 H3.3 NOREF.1 OLED1.1 R36.1 R47.2 R49.1 R50.1 speaker-.1 U1.1 U23.1 U23.3 U23.9 U24.2 U24.4 U28.9 USB2.7 USB2.8 USB2.9 USB2.10 USB2.A12 USB2.B12

Pads without a net: U1 16 17 18 19 20; U28 2 4 7

## Via types
v1: diameter 0.61, hole 0.305, Top Layer to Bottom Layer, 105 vias

## Routing (per net, layer and track width the routed paths; a pad name or vN(x,y) marks a point on that pad's centre or on a via; arc(x,y) is an arc through that point)
+5V: length 19.4
  Bottom Layer w0.5: USB2.B9 45.3,68.62 45.97,67.94 48.34,67.94 ; 48.34,67.94 55.24,67.94 56.64,69.34 56.64,73.79 R33.1 ; 48.34,67.94 USB2.A9
BAT: length 15.2
  Bottom Layer w0.5: U24.3 71.73,67.02 71.73,66.39 71.37,66.04 70.1,66.04 69.81,66.33 U24.1 69.89,67.12 C37.2 C39.2 69.89,73.56 BAT+.1 69.58,73.87 C35.1 66.85,72.5 U23.5
EN: length 2.4
  Bottom Layer w0.254: R45.1 12.57,70.19 U28.3
IO0: length 62.8
  Top Layer w0.254: v1(16.61,57.62) 13.25,57.62 10.16,60.71 10.16,73.29 10.84,73.96 30.05,73.96 30.99,73.02
  Bottom Layer w0.254: R44.1 33.16,60.72 31.47,59.03 17.25,59.03 16.61,58.39 v1(16.61,57.62) U28.12
IO2: length 20.8
  Bottom Layer w0.254: U28.11 18.61,58.23 19.05,58.67 33.13,58.67 R48.1
IO15: length 9.1
  Bottom Layer w0.254: R47.1 25.77,57.66 21.08,57.66 20.61,57.18 U28.10
RST: length 2.4
  Bottom Layer w0.254: R46.1 8.76,70.32 U28.1
RX: length 43.8
  Top Layer w0.254: H3.4 33.53,73.53 32.74,74.32 10.69,74.32 9.78,73.41 9.78,60.2 9.99,59.99 v1(9.99,59.44)
  Bottom Layer w0.254: U28.15 10.61,56.56 9.78,57.39 9.78,58.67 9.99,58.88 v1(9.99,59.44)
SCL: length 92.5
  Bottom Layer w0.254: OLED1.3 63.63,60.71 63.88,60.71 64.45,60.13 64.45,57.19 63.9,56.64 49.79,56.64 48.89,57.54 48.89,58.55 48.7,58.74 U1.21 48.7,61.15 47.82,62.04 40.2,62.04 38.99,60.83 38.99,54.1 37.09,52.2 13.82,52.2 13.43,52.59 13.43,52.73 12.61,53.56 U28.14 12.57,55.09 12.57,59.18 13.13,59.74 28.48,59.74 29.46,60.72
SDA: length 88.1
  Bottom Layer w0.254: OLED1.4 63.75,58.42 64.01,58.17 64.01,57.51 63.5,57 49.94,57 49.25,57.68 49.25,58.52 49.34,58.61 U1.22 49.34,61.02 47.96,62.4 40.05,62.4 38.63,60.98 38.63,54.25 36.94,52.55 13.96,52.55 13.78,52.73 14.61,53.56 U28.13 14.61,58.55 15.44,59.39 30.03,59.39 31.37,60.72
SPEACK: length 61.8
  Top Layer w0.254: speaker+.1 51.1,56.6 50.11,57.58 50.11,66.22 49.28,67.06 v1(18.48,67.06)
  Bottom Layer w0.254: v1(18.48,67.06) 18.48,70.04 U28.6
SYS_GND: length 2.4
  Bottom Layer w0.254: 71.25,70.49 71.25,70.69 ; C37.1 71.89,68.71 70.87,67.69 70.87,67.15 U24.2
  vias: v1(0.66,72.59) v1(0.63,52.7) v1(0.63,50.04) v1(1.91,52.7) v1(1.94,72.59) v1(3.21,72.59) v1(3.19,52.7) v1(3.95,50.04) v1(4.49,72.59) v1(4.47,52.7) v1(5.77,72.59) v1(5.75,52.7) v1(6.98,70.48) v1(6.98,68.91) v1(6.98,67.34) v1(6.98,65.76) v1(6.98,64.19) v1(6.98,62.61) v1(6.98,61.04) v1(6.98,59.46) v1(6.98,57.89) v1(6.98,56.31) v1(6.98,54.74) v1(7.03,53.09) v1(7.05,71.95) v1(7.26,50.04) v1(10.57,50.04) v1(11.45,67.31) v1(11.43,65.28) v1(11.43,63.25) v1(11.43,61.11) v1(13.88,50.04) v1(15.4,72.52) v1(15.62,67.31) v1(15.6,65.25) v1(15.61,63.25) v1(15.6,61.09) v1(17.19,50.04) v1(18.41,72.52) v1(19.66,65.25) v1(19.69,63.25) v1(19.68,61.09) v1(20.5,50.04) v1(23.81,50.04) v1(27.12,50.04) v1(30.43,50.04) v1(30.84,65.25) v1(30.84,55.09) v1(33.75,50.04) v1(35.92,55.09) v1(37.06,50.04) v1(41,70.33) v1(41,65.25) v1(46.08,65.25) v1(51.16,65.25) v1(53.61,50.04) v1(56.24,65.25) v1(56.24,55.09) v1(56.92,50.04) v1(60.23,50.04) v1(61.32,65.25) v1(61.32,55.09) v1(63.55,50.04) v1(66.4,55.09) v1(66.86,50.04) v1(70.17,50.04) v1(71.48,60.17) v1(71.48,55.09) v1(73.48,50.04) v1(76.56,70.33) v1(76.56,65.25) v1(76.56,60.17) v1(76.56,55.09) v1(76.79,50.04) v1(80.1,50.04) v1(81.64,70.33) v1(81.64,65.25) v1(81.64,60.17) v1(81.64,55.09) v1(83.41,50.04) v1(86.72,70.33) v1(86.72,65.25) v1(86.72,60.17) v1(86.72,55.09) v1(86.72,50.04) v1(90.03,50.04) v1(91.8,70.33) v1(91.8,65.25) v1(91.8,60.17) v1(91.8,55.09) v1(93.34,50.04)
SYSTEM_3V3: length 88.2
  Bottom Layer w0.5: 50.61,60.21 50.67,60.28 50.67,61.98 49.71,62.94 36.12,62.94 ; 50.61,60.21 U1.24 ; 50.61,60.21 C42.1 60.09,60.21 OLED1.2 64.26,64.39 69.76,64.39 U24.5 ; 22.61,74.68 25.78,74.68 26.67,73.79 26.67,64.26 27.99,62.94 36.12,62.94 ; 22.61,74.68 22.61,73.17 C44.1 22.61,72.88 U28.8 ; 22.61,74.68 8.91,74.68 R46.2 ; 36.12,62.94 36.07,62.99 H3.5
TOUCH: length 42.8
  Top Layer w0.254: v1(49.53,61.85) 49.53,65.91 48.97,66.47 17.22,66.47 16.64,67.06 v1(16.64,67.56)
  Bottom Layer w0.254: U1.23 49.97,61.4 v1(49.53,61.85) ; U28.5 16.64,70.13 v1(16.64,67.56)
TP4056_VCC: length 57.2
  Top Layer w0.254: v1(87.12,72.39) 84.2,72.39 83.39,71.58 70.46,71.58 67.82,68.94 v1(67.82,68.58) 60.96,68.58 59.56,69.98 v1(59.56,72.06)
  Bottom Layer w0.254: v1(67.82,68.58) 67.49,68.25 U23.8 ; v1(87.12,72.39) 88.51,72.39 Charge1.1 88.76,74.93 76.5,74.93 100%.1 ; U23.4 v1(59.56,72.06)
  Bottom Layer w0.5: U23.4 60.68,72.14 C34.1 60.66,73.87 R33.2
TX: length 47
  Top Layer w0.254: H3.6 36.07,73.41 34.8,74.68 10.54,74.68 9.43,73.56 9.43,60.2 9.22,59.99 v1(9.22,59.44)
  Bottom Layer w0.254: U28.16 8.61,56.56 9.43,57.39 9.43,58.67 9.22,58.88 v1(9.22,59.44)
$1N1082: length 2.3
  Bottom Layer w0.254: 100%.2 R35.1
$1N1083: length 16.7
  Top Layer w0.254: v1(80.64,72.52) 80.42,72.29 69.24,72.29 68.2,71.25 v1(67.69,71.25)
  Bottom Layer w0.254: R35.2 81.72,73.6 v1(80.64,72.52) ; U23.6 67.24,70.79 v1(67.69,71.25)
$1N1087: length 19.3
  Top Layer w0.254: v1(82.93,72.39) 82.47,71.93 69.9,71.93 67.95,69.98 v1(67.82,69.98)
  Bottom Layer w0.254: R34.1 82.93,73.18 v1(82.93,72.39) ; v1(67.82,69.98) 66.87,69.98 U23.7
$1N1088: length 2.3
  Bottom Layer w0.254: R34.2 Charge1.2
$1N1093: length 1.9
  Bottom Layer w0.5: R36.2 58.87,69.52 U23.2
$1N5168: length 4.5
  Top Layer w0.254: v1(48.77,56.39) 47.75,57.41 C40.1
  Bottom Layer w0.254: U1.3 49.34,55.82 v1(48.77,56.39)
$1N5240: length 4.6
  Bottom Layer w0.254: U1.2 49.97,53.53 50.17,53.34 52.72,53.34 C41.1
$1N9530: length 3
  Bottom Layer w0.127: 48.7,54.61 48.7,53.7 49.84,52.56 RN1.4
$1N9534: length 78.9
  Bottom Layer w0.127: 49.84,50.36 49.84,49.6 50.17,49.28 89.41,49.28 90.17,48.51 90.17,26.16 87.63,23.62 87.63,12.19
$1N9539: length 46.8
  Bottom Layer w0.127: 49.02,50.29 49.02,49.28 49.53,48.77 80.64,48.77 81.06,48.35 81.06,34.98
$1N9544: length 63.5
  Bottom Layer w0.127: 48.24,50.4 48.24,49.04 49.02,48.26 73.79,48.26 74.18,47.86 74.18,12.19
$1N9549: length 34.5
  Bottom Layer w0.127: 67.31,34.92 67.31,47.5 67.06,47.75 48.51,47.75 47.44,48.82 47.44,50.29
$1N9554: length 51.5
  Bottom Layer w0.127: RN2.5 46.03,48.58 47.37,47.24 59.94,47.24 60.66,46.53 U27.8
$1N9559: length 22.9
  Bottom Layer w0.127: RN2.6 45.23,48.24 46.74,46.74 53.47,46.74 53.85,46.35 53.85,34.92
$1N9564: length 39.2
  Bottom Layer w0.127: U27.6 47.15,22.7 44.43,25.42 RN2.7
$1N9569: length 44.7
  Bottom Layer w0.127: RN2.8 43.63,48.2 42.29,46.86 37.97,46.86 37.46,46.35 37.46,25.65 33.78,21.97 33.78,12.19
$1N9574: length 29.3
  Bottom Layer w0.127: RN3.5 42.22,48.44 41.15,47.37 28.07,47.37 27.09,46.39 27.09,34.96
$1N9579: length 58.4
  Bottom Layer w0.127: RN3.6 41.42,48.79 40.51,47.88 20.78,47.88 20.27,47.37 20.27,12.19
$1N9584: length 42
  Bottom Layer w0.127: 13.33,34.92 13.33,47.88 13.84,48.39 40,48.39 40.62,49 RN3.7
$1N9589: length 74.5
  Bottom Layer w0.127: RN3.8 39.82,49.28 39.44,48.89 4.57,48.89 3.81,48.13 3.81,24.64 6.73,21.72 6.73,12.32
$1N9594: length 15.1
  Bottom Layer w0.127: RN3.1 39.82,60.01 41.27,61.47 44.45,61.47 44.89,61.02 U1.15
$1N9599: length 13
  Bottom Layer w0.127: U1.14 44.26,60.77 44.07,60.96 41.66,60.96 40.62,59.92 RN3.2
$1N9607: length 10.7
  Bottom Layer w0.127: U1.13 43.62,60.26 43.56,60.32 41.91,60.32 41.42,59.84 RN3.3
$1N9626: length 2.6
  Bottom Layer w0.127: 44.89,54.48 44.89,53.19 44.43,52.73 RN2.2
$1N9631: length 2.5
  Bottom Layer w0.127: 45.49,54.48 45.49,53.07 45.23,52.81 RN2.3
$1N9636: length 2.5
  Bottom Layer w0.127: RN2.4 46.03,52.89 46.16,53.02 46.16,54.48
$1N9641: length 2.7
  Bottom Layer w0.127: RN1.1 47.44,52.81 46.8,53.45 46.8,54.55
$1N9648: length 2.9
  Bottom Layer w0.127: RN1.2 48.24,52.72 47.37,53.59 47.37,54.61
$1N9654: length 2.9
  Bottom Layer w0.127: RN1.3 49.04,52.64 48.07,53.61 48.07,54.61
$1N9658: length 2.7
  Bottom Layer w0.127: 44.26,54.48 44.26,53.28 43.63,52.65 RN2.1
$1N9661: length 3
  Bottom Layer w0.127: RN3.4 42.22,52.13 43.62,53.53 43.62,54.48
$1N13236: length 8.2
  Bottom Layer w0.254: R49.2 45.32,72.41 46.32,71.41 USB2.A5
$1N13292: length 7.9
  Bottom Layer w0.254: R50.2 52.9,72.26 48.26,72.26 47.32,71.32 USB2.B5

## Copper pours and planes (outline as drawn; the poured copper is in the pictures)
SYS_GND on Top Layer: -2.67,77.6 95,77.6 95,47.75 -2.67,47.75
SYS_GND on Top Layer: -2.79,49.4 96.27,49.4 96.27,-2.29 -2.79,-2.29
SYS_GND on Bottom Layer: -4.19,49.91 97.54,49.91 97.54,-0.76 -4.19,-0.76
SYS_GND on Bottom Layer: -1.78,76.33 97.41,76.33 97.41,49.91 -1.78,49.91

Small or netless copper shapes (teardrops, artwork), in the pictures only: 19 on Top Layer, 153 on Bottom Layer

## Text on the board
Bottom Silkscreen Layer: BAT-
Top Silkscreen Layer: DEBUG | GND | RX | 3V3 | TX | 触控调节 | EDA-Piano | V1.0
